# EAGLE design multiswitch2.2 (EAGLE 9.6.1)
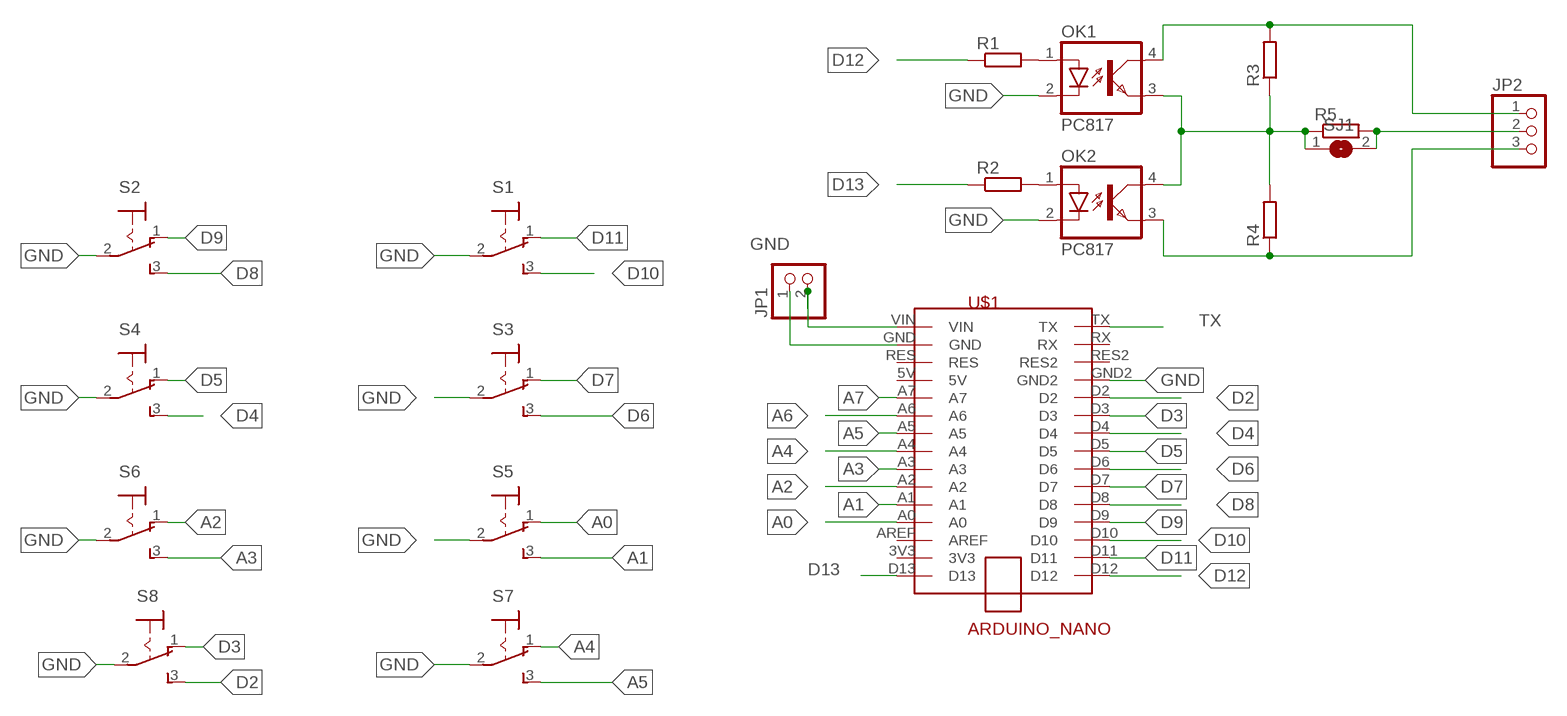
[diagram p0: schematic, sheet 1]

## Parts
JP1  PINHD-1X2  [1X02]
JP2  PINHD-1X3  [1X03]
OK1  PC817  [DIL04]
OK2  PC817  [DIL04]
R1  R-EU_0204/7  [0204/7]
R2  R-EU_0204/7  [0204/7]
R3  R-EU_0204/7  [0204/7]
R4  R-EU_0204/7  [0204/7]
R5  R-EU_0204/7  [0204/7]
S1  M9040P  [M9040P]
S2  M9040P  [M9040P]
S3  M9040P  [M9040P]
S4  M9040P  [M9040P]
S5  M9040P  [M9040P]
S6  M9040P  [M9040P]
S7  M9040P  [M9040P]
S8  M9040P  [M9040P]
SJ1  SJ  [SJ]
U$1  ARDUINO_NANO  [ARDUIN_NANO]

## Nets
A0: S5.1(O) U$1.A0
A1: S5.3(S) U$1.A1
A2: S6.1(O) U$1.A2
A3: S6.3(S) U$1.A3
A4: S7.1(O) U$1.A4
A5: S7.3(S) U$1.A5
A6: U$1.A6
A7: U$1.A7
D2: S8.3(S) U$1.D2
D3: S8.1(O) U$1.D3
D4: S4.3(S) U$1.D4
D5: S4.1(O) U$1.D5
D6: S3.3(S) U$1.D6
D7: S3.1(O) U$1.D7
D8: S2.3(S) U$1.D8
D9: S2.1(O) U$1.D9
D10: S1.3(S) U$1.D10
D11: S1.1(O) U$1.D11
D12: R1.1 U$1.D12
D13: R2.1 U$1.D13
GND: JP1.1 OK1.2(C) OK2.2(C) S1.2(P) S2.2(P) S3.2(P) S4.2(P) S5.2(P) S6.2(P) S7.2(P) S8.2(P) U$1.GND U$1.GND2
N$1: OK1.1(A) R1.2
N$2: OK2.1(A) R2.2
N$3: JP2.1 OK1.4(COL) R3.2
N$4: OK1.3(EMIT) OK2.4(COL) R3.1 R4.2 R5.1 SJ1.1
N$6: JP2.3 OK2.3(EMIT) R4.1
N$8: JP2.2 R5.2 SJ1.2
N$9: JP1.2 U$1.VIN
TX: U$1.TX
Unconnected: U$1.3V3 U$1.5V U$1.AREF U$1.RES U$1.RES2 U$1.RX

## Library data of the parts
JP1 = pinhead:PINHD-1X2: PIN HEADER
JP2 = 00_custom_pinhead:PINHD-1X3: PIN HEADER
OK1 OK2 = optocoupler:PC817: SHARP OPTO COUPLER; MPN: PC817X4J000F; OC_FARNELL: 9707727; OC_NEWARK: 97K7059
R1-R5 = rcl:R-EU_: RESISTOR, European symbol; SPICEPREFIX: R
S1-S8 = switch2:M9040P: TOGGLE SWITCH Marquardt
SJ1 = jumper:SJ: SMD solder JUMPER
U$1 = Arduino:ARDUINO_NANO

## Board
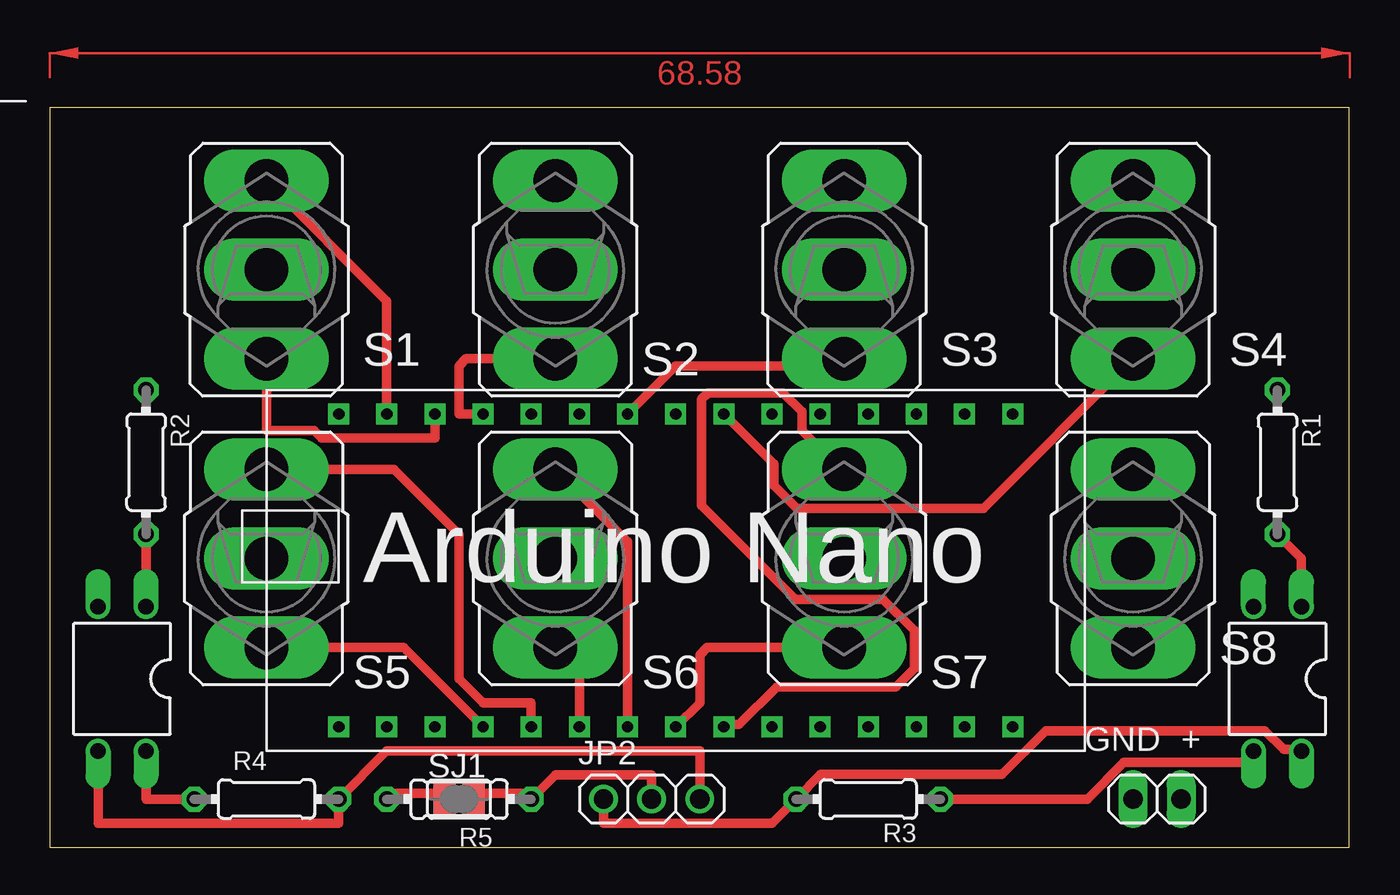
[diagram p1: board, top side]
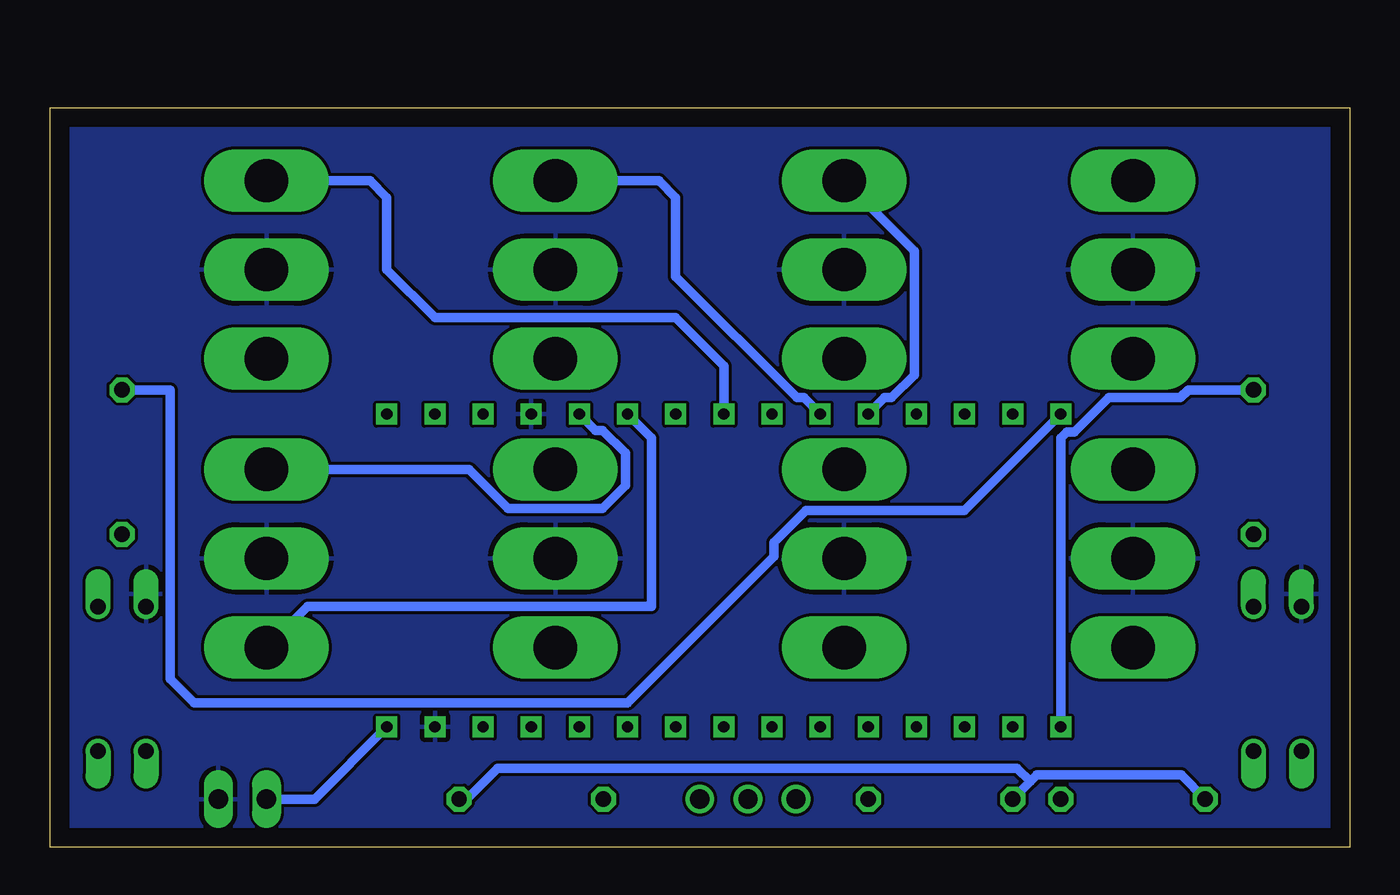
[diagram p2: board, bottom side, seen from below]

Size 68.56 x 39.04 mm. Coordinates in mm from the lower left corner, seen from the top.
Outline: 0,0 68.56,0 68.56,39.04 0,39.04 0,0
Copper layers (1*16): Top 0.035mm / dielectric 1.5mm / Bottom 0.035mm
Design rules "default *": minimum track width 20mil, minimum drill 0.35mm, track to track 6mil, track to pad 6mil, pad to pad 6mil, via to via 6mil, smd to smd 6mil, copper to edge 40mil, drill to drill 6mil, minimum pad ring 10mil, minimum via ring 8mil, stop-mask expansion 4mil, vias tented up to drill 0mil, thermal gap 10mil

### Footprints (pad centres in the part's own frame; a part is rotated, then mirrored left to right if it is on the bottom)
1X02 = drill 1.016 long: 1 -1.27,0; 2 1.27,0
1X03 = drill 1.016 pad 1.524: 1 -2.54,0; 2 0,0; 3 2.54,0
DIL04 = drill 0.813 offset: 1 -1.27,-3.81; 2 1.27,-3.81; 3 1.27,3.81; 4 -1.27,3.81
0204/7 = drill 0.813 octagon: 1 -3.81,0; 2 3.81,0
M9040P = drill 2.286 long: 1 0,4.699; 2 0,0; 3 0,-4.699
SJ = smd 1.168 x 1.6: 1 -0.762,0; 2 0.762,0
ARDUIN_NANO = drill 0.6 square: 3V3 3.81,8.89; 5V 3.81,34.29; A0 3.81,13.97; A1 3.81,16.51; A2 3.81,19.05; A3 3.81,21.59; A4 3.81,24.13; A5 3.81,26.67; A6 3.81,29.21; A7 3.81,31.75; AREF 3.81,11.43; D2 -12.7,31.75; D3 -12.7,29.21; D4 -12.7,26.67; D5 -12.7,24.13; D6 -12.7,21.59; D7 -12.7,19.05; D8 -12.7,16.51; D9 -12.7,13.97; D10 -12.7,11.43; D11 -12.7,8.89; D12 -12.7,6.35; D13 3.81,6.35; GND 3.81,39.37; GND2 -12.7,34.29; RES 3.81,36.83; RES2 -12.7,36.83; RX -12.7,39.37; TX -12.7,41.91; VIN 3.81,41.91

### Placement (x,y rotation side)
JP1  58.42,2.54 180 top
JP2  31.75,2.54 0 top
OK1  64.77,8.89 180 top
OK2  3.81,8.89 180 top
R1  64.77,20.32 270 top
R2  5.08,20.32 270 top
R3  43.18,2.54 180 top
R4  11.43,2.54 180 top
R5  21.59,2.54 0 top
S1  11.43,30.48 0 top
S2  26.67,30.48 180 top
S3  41.91,30.48 0 top
S4  57.15,30.48 0 top
S5  11.43,15.24 180 top
S6  26.67,15.24 180 top
S7  41.91,15.24 180 top
S8  57.15,15.24 180 top
SJ1  21.59,2.54 0 top
U$1  8.89,10.16 270 top

### Tracks (layer width: path | path; a pad name or v marks a point on that pad's centre or on a via)
A0
  Top 0.508: S5.1 18.67,10.54 U$1.A0
A1
  Top 0.508: S5.3 18.16,19.94 21.59,16.51 21.59,8.89 22.86,7.62 25.4,7.62 U$1.A1
A2
  Top 0.508: S6.1 27.94,9.27 U$1.A2
A3
  Top 0.508: S6.3 30.48,16.13 U$1.A3
A4
  Top 0.508: U$1.A4 34.29,7.62 34.29,10.16 34.67,10.54 S7.1
A5
  Top 0.508: U$1.A5 35.71,6.48 36.37,6.48 38.35,8.46 44.63,8.46 45.62,9.45 45.62,11.43 43.97,13.08 39.34,13.08 34.39,18.03 34.39,23.65 34.72,23.98 38.68,23.98 39.67,22.99 39.67,22 41.66,20.02 S7.3
D2
  Bottom 0.508: U$1.D2 39.78,22 39.41,22 38.2,20.79 38.2,19.09 39.41,17.88 44.41,17.88 46.47,19.94 S8.3
D3
  Bottom 0.508: S8.1 54.99,12.7 36.83,12.7 36.83,21.59 U$1.D3
D4
  Top 0.508: U$1.D4 38.2,20.22 38.2,19.09 39.41,17.88 49.25,17.88 S4.3
D5
  Bottom 0.508: U$1.D5 33.02,25.4 35.56,27.94 48.26,27.94 50.8,30.48 50.8,34.29 51.69,35.18 S4.1
D6
  Top 0.508: U$1.D6 33.02,25.4 41.53,25.4 S3.3
D7
  Bottom 0.508: U$1.D7 28.8,23.72 29.17,23.72 35.56,30.11 35.56,34.29 36.45,35.18 S3.1
D8
  Bottom 0.508: U$1.D8 24.54,23.72 24.17,23.72 22.96,24.93 22.96,31.47 S2.3
D9
  Top 0.508: U$1.D9 21.59,22.86 21.59,25.4 21.97,25.78 S2.1
D10
  Top 0.508: S1.3 11.43,22 13.93,22 14.34,21.59 20.32,21.59 U$1.D10
D11
  Top 0.508: S1.1 17.78,28.83 U$1.D11
D12
  Bottom 0.508: U$1.D12 20.32,17.78 28.69,17.78 30.38,16.09 30.38,15.34 38.1,7.62 60.96,7.62 62.23,8.89 62.23,24.13 R1.1
D13
  Bottom 0.508: U$1.D13 15.24,21.59 14.93,21.9 14.52,21.9 12.69,23.72 8.93,23.72 8.52,24.13 R2.1
GND
  pour Bottom: -8.89,39.37 -8.89,-6.35 69.85,-6.35 69.85,39.37
N$1
  Top 0.508: R1.2 66.04,15.24 OK1.1
N$2
  Top 0.508: R2.2 OK2.1
N$3
  Top 0.508: JP2.1 29.21,1.27 38.1,1.27 R3.2 40.66,3.84 50.24,3.84 52.55,6.15 64.11,6.15 65.1,5.16 65.76,5.16 OK1.4
N$4
  Top 0.508: R3.1 54.74,2.54 56.67,4.47 62.89,4.47 OK1.3 | OK2.4 5.08,2.54 R4.2 | SJ1.1 20.52,2.84 17.88,2.84 R5.1
  Bottom 0.508: R4.2 8.89,3.81 16.51,3.81 16.85,3.47 | 16.85,3.47 R5.1 | 16.85,3.47 17.55,4.17 44.96,4.17 46.61,2.52 46.94,2.52 R3.1
N$6
  Top 0.508: OK2.3 2.54,1.27 15.24,1.27 R4.1 17.78,5.08 34.29,5.08 JP2.3
N$8
  Top 0.508: JP2.2 31.75,3.81 26.67,3.81 R5.2 25.15,2.84 22.5,2.84 SJ1.2
N$9
  Bottom 0.508: U$1.VIN 54.61,2.54 JP1.2
(copper drawn outside any net)
  shapes: Top area x1

### Text on the board
tPlace: GND | +